# Altium schematic sheet con-bot-j1-1.SchDoc: Connector - J1(Bottom) 1
size Letter; CheckedBy: E. Chiu; CompanyName: Signal Laboratories, Inc.; DrawnBy: J. Brinton; Engineer: J. Brinton; Address1: 3479 Edison Way; Address2: Menlo Park CA 94025; Address3: +1 (877) 778-8435; Address4: brintonengineering.com; Revision: 1; SheetNumber: 19; SheetTotal: 40
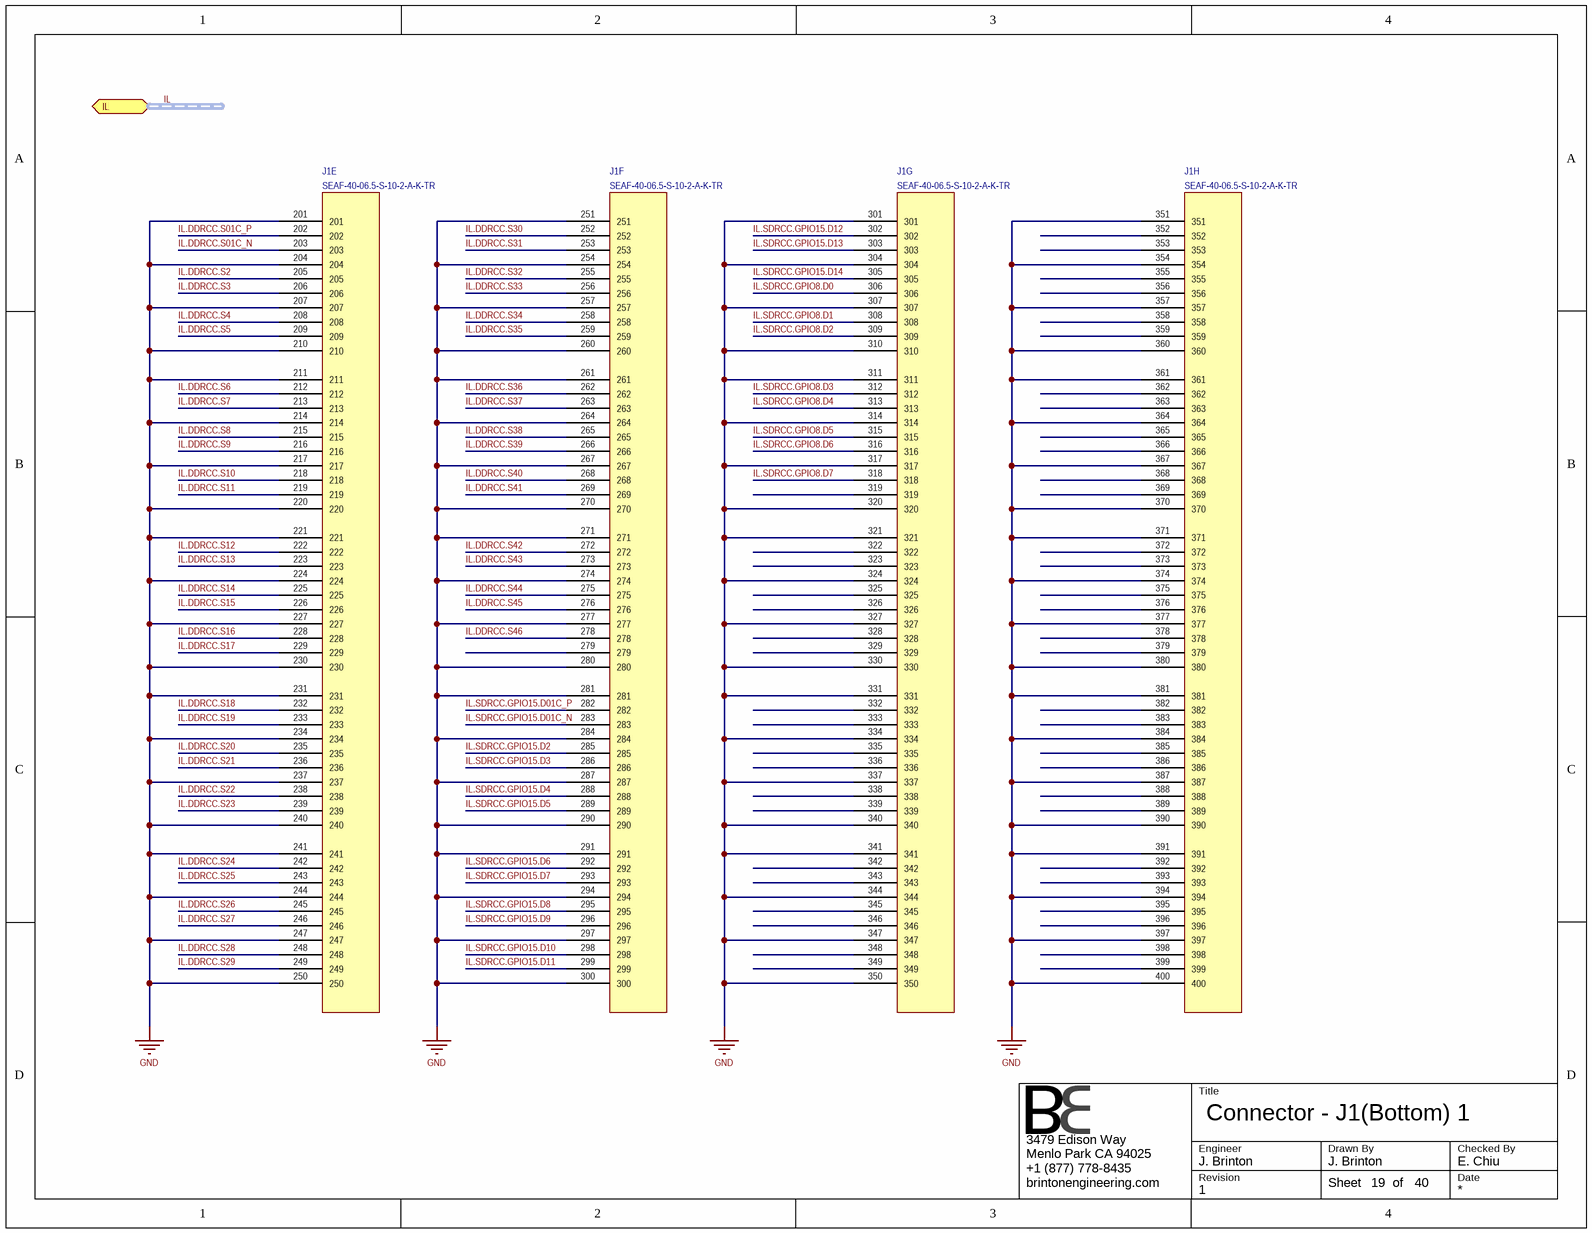
[diagram p0: con-bot-j1-1.SchDoc]

## Parts
J1  SEAF-40-06.5-S-10-2-A-K-TR  [SEAF-40-06.5-S-10-2-A-K-TR]  (parts E,F,G,H of 8)

## Ports
IL (harness IL-1V5)

## Nets
GND: J1.201 J1.204 J1.207 J1.210 J1.211 J1.214 J1.217 J1.220 J1.221 J1.224 J1.227 J1.230 J1.231 J1.234 J1.237 J1.240 J1.241 J1.244 J1.247 J1.250 J1.251 J1.254 J1.257 J1.260 J1.261 J1.264 J1.267 J1.270 J1.271 J1.274 J1.277 J1.280 J1.281 J1.284 J1.287 J1.290 J1.291 J1.294 J1.297 J1.300 J1.301 J1.304 J1.307 J1.310 J1.311 J1.314 J1.317 J1.320 J1.321 J1.324 J1.327 J1.330 J1.331 J1.334 J1.337 J1.340 J1.341 J1.344 J1.347 J1.350 J1.351 J1.354 J1.357 J1.360 J1.361 J1.364 J1.367 J1.370 J1.371 J1.374 J1.377 J1.380 J1.381 J1.384 J1.387 J1.390 J1.391 J1.394 J1.397 J1.400
IL.DDRCC.S01C_N: J1.203
IL.DDRCC.S01C_P: J1.202
IL.DDRCC.S2: J1.205
IL.DDRCC.S3: J1.206
IL.DDRCC.S4: J1.208
IL.DDRCC.S5: J1.209
IL.DDRCC.S6: J1.212
IL.DDRCC.S7: J1.213
IL.DDRCC.S8: J1.215
IL.DDRCC.S9: J1.216
IL.DDRCC.S10: J1.218
IL.DDRCC.S11: J1.219
IL.DDRCC.S12: J1.222
IL.DDRCC.S13: J1.223
IL.DDRCC.S14: J1.225
IL.DDRCC.S15: J1.226
IL.DDRCC.S16: J1.228
IL.DDRCC.S17: J1.229
IL.DDRCC.S18: J1.232
IL.DDRCC.S19: J1.233
IL.DDRCC.S20: J1.235
IL.DDRCC.S21: J1.236
IL.DDRCC.S22: J1.238
IL.DDRCC.S23: J1.239
IL.DDRCC.S24: J1.242
IL.DDRCC.S25: J1.243
IL.DDRCC.S26: J1.245
IL.DDRCC.S27: J1.246
IL.DDRCC.S28: J1.248
IL.DDRCC.S29: J1.249
IL.DDRCC.S30: J1.252
IL.DDRCC.S31: J1.253
IL.DDRCC.S32: J1.255
IL.DDRCC.S33: J1.256
IL.DDRCC.S34: J1.258
IL.DDRCC.S35: J1.259
IL.DDRCC.S36: J1.262
IL.DDRCC.S37: J1.263
IL.DDRCC.S38: J1.265
IL.DDRCC.S39: J1.266
IL.DDRCC.S40: J1.268
IL.DDRCC.S41: J1.269
IL.DDRCC.S42: J1.272
IL.DDRCC.S43: J1.273
IL.DDRCC.S44: J1.275
IL.DDRCC.S45: J1.276
IL.DDRCC.S46: J1.278
IL.SDRCC.GPIO8.D0: J1.306
IL.SDRCC.GPIO8.D1: J1.308
IL.SDRCC.GPIO8.D2: J1.309
IL.SDRCC.GPIO8.D3: J1.312
IL.SDRCC.GPIO8.D4: J1.313
IL.SDRCC.GPIO8.D5: J1.315
IL.SDRCC.GPIO8.D6: J1.316
IL.SDRCC.GPIO8.D7: J1.318
IL.SDRCC.GPIO15.D01C_N: J1.283
IL.SDRCC.GPIO15.D01C_P: J1.282
IL.SDRCC.GPIO15.D2: J1.285
IL.SDRCC.GPIO15.D3: J1.286
IL.SDRCC.GPIO15.D4: J1.288
IL.SDRCC.GPIO15.D5: J1.289
IL.SDRCC.GPIO15.D6: J1.292
IL.SDRCC.GPIO15.D7: J1.293
IL.SDRCC.GPIO15.D8: J1.295
IL.SDRCC.GPIO15.D9: J1.296
IL.SDRCC.GPIO15.D10: J1.298
IL.SDRCC.GPIO15.D11: J1.299
IL.SDRCC.GPIO15.D12: J1.302
IL.SDRCC.GPIO15.D13: J1.303
IL.SDRCC.GPIO15.D14: J1.305

Not connected (* = marked no-connect by the designer): J1 279 319 322 323 325 326 328 329 332 333 335 336 338 339 342 343 345 346 348 349 352 353 355 356 358 359 362 363 365 366 368 369 372 373 375 376 378 379 382 383 385 386 388 389 392 393 395 396 398 399

## Buses and harness runs
harness IL = port IL

## Notes on the sheet
- Title
- Engineer
- Revision
- Drawn By
- Checked By
- Date
- Sheet
- of

## Library data of the parts
J1 = SEAF-40-06.5-S-10-2-A-K-TR: Terminal Array Assembly, Surface Mount, 0.050" Pitch, 400 Pins; Manufacturer: Samtec; Manufacturer P/N: SEAF-40-06.5-S-10-2-A-K-TR